# Altium schematic sheet imxbb232.SchDoc: IMXBB
size A3; DocumentNumber: 5; Revision: 2.0; SheetNumber: 5; SheetTotal: 9
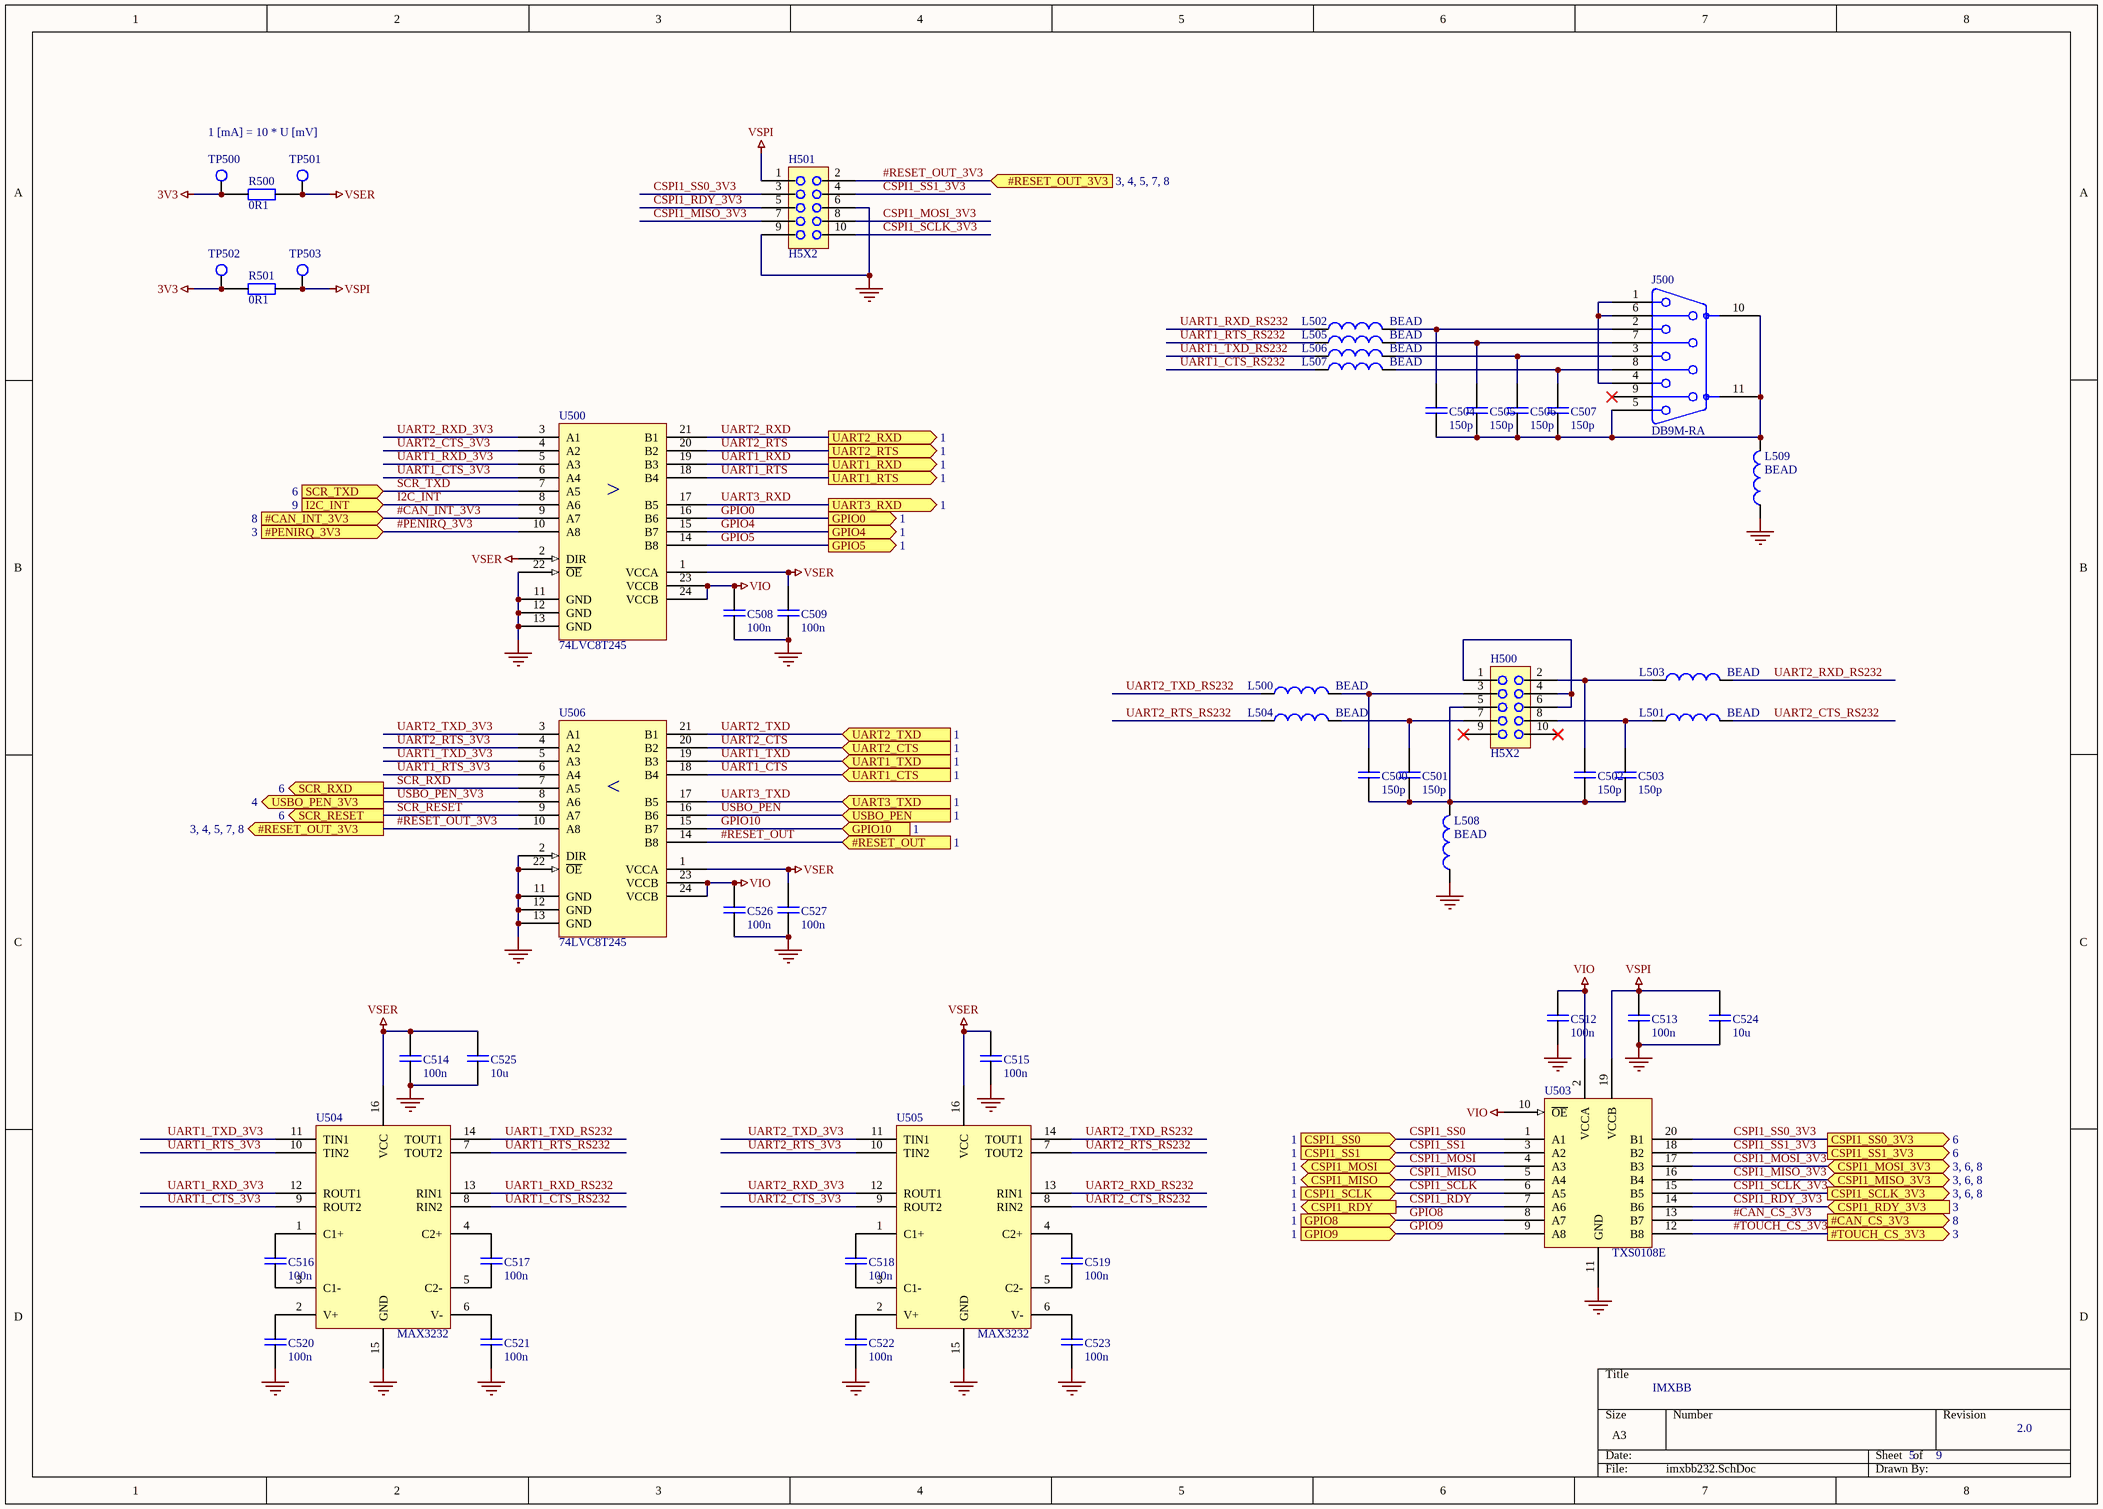
[diagram p0: imxbb232.SchDoc]

## Parts
C500  150p  [0603]
C501  150p  [0603]
C502  150p  [0603]
C503  150p  [0603]
C504  150p  [0603]
C505  150p  [0603]
C506  150p  [0603]
C507  150p  [0603]
C508  100n  [0603]
C509  100n  [0603]
C512  100n  [0603]
C513  100n  [0603]
C514  100n  [0603]
C515  100n  [0603]
C516  100n  [0603]
C517  100n  [0603]
C518  100n  [0603]
C519  100n  [0603]
C520  100n  [0603]
C521  100n  [0603]
C522  100n  [0603]
C523  100n  [0603]
C524  10u  [0805]
C525  10u  [0805]
C526  100n  [0603]
C527  100n  [0603]
H500  H5X2  [H2x5]
H501  H5X2  [H2x5]
J500  DB9M-RA  [DRA9_M_RA]
L500  BEAD  [0603]
L501  BEAD  [0603]
L502  BEAD  [0603]
L503  BEAD  [0603]
L504  BEAD  [0603]
L505  BEAD  [0603]
L506  BEAD  [0603]
L507  BEAD  [0603]
L508  BEAD  [0603]
L509  BEAD  [0603]
R500  0R1  [0603]
R501  0R1  [0603]
TP500  TESTPOINT  [TESTPOINT_2mm]  (value not drawn)
TP501  TESTPOINT  [TESTPOINT_2mm]  (value not drawn)
TP502  TESTPOINT  [TESTPOINT_2mm]  (value not drawn)
TP503  TESTPOINT  [TESTPOINT_2mm]  (value not drawn)
U500  74LVC8T245  [TSSOP24]
U503  TXS0108E  [TSSOP20]
U504  MAX3232  [SOIC16N]
U505  MAX3232  [SOIC16N]
U506  74LVC8T245  [TSSOP24]

## Ports
#CAN_CS_3V3 (out, see 8), #CAN_INT_3V3 (in, see 8), #PENIRQ_3V3 (in, see 3), #RESET_OUT (in, see 1), #RESET_OUT_3V3 (in, see 3, 4, 5, 7, 8), #RESET_OUT_3V3 (out, see 3, 4, 5, 7, 8), #TOUCH_CS_3V3 (out, see 3), CSPI1_MISO (bidir, see 1), CSPI1_MISO_3V3 (bidir, see 3, 6, 8), CSPI1_MOSI (bidir, see 1), CSPI1_MOSI_3V3 (bidir, see 3, 6, 8), CSPI1_RDY (out, see 1), CSPI1_RDY_3V3 (in, see 3), CSPI1_SCLK (in, see 1), CSPI1_SCLK_3V3 (out, see 3, 6, 8), CSPI1_SS0 (in, see 1), CSPI1_SS0_3V3 (out, see 6), CSPI1_SS1 (in, see 1), CSPI1_SS1_3V3 (out, see 6), GPIO0 (out, see 1), GPIO4 (out, see 1), GPIO5 (out, see 1), GPIO8 (in, see 1), GPIO9 (in, see 1), GPIO10 (in, see 1), I2C_INT (in, see 9), SCR_RESET (out, see 6), SCR_RXD (out, see 6), SCR_TXD (in, see 6), UART1_CTS (in, see 1), UART1_RTS (out, see 1), UART1_RXD (out, see 1), UART1_TXD (in, see 1), UART2_CTS (in, see 1), UART2_RTS (out, see 1), UART2_RXD (out, see 1), UART2_TXD (in, see 1), UART3_RXD (out, see 1), UART3_TXD (in, see 1), USBO_PEN (in, see 1), USBO_PEN_3V3 (out, see 4)

## Nets
3V3: R500.1 R501.1 TP500.1 TP502.1
GND: C508.1 C509.1 C512.1 C513.1 C514.1 C515.1 C520.1 C521.1 C522.1 C523.1 C524.1 C525.1 C526.1 C527.1 H501.6 H501.9 L508.1 L509.1 U500.11(GND) U500.12(GND) U500.13(GND) U500.22(~{OE}) U503.11(GND) U504.15(GND) U505.15(GND) U506.2(DIR) U506.11(GND) U506.12(GND) U506.13(GND) U506.22(~{OE})
VIO: C508.2 C512.2 C526.2 U500.23(VCCB) U500.24(VCCB) U503.2(VCCA) U503.10(~{OE}) U506.23(VCCB) U506.24(VCCB)
VSER: C509.2 C514.2 C515.2 C525.2 C527.2 R500.2 TP501.1 U500.1(VCCA) U500.2(DIR) U504.16(VCC) U505.16(VCC) U506.1(VCCA)
VSPI: C513.2 C524.2 H501.1 R501.2 TP503.1 U503.19(VCCB)
#CAN_CS_3V3: U503.13(B7) ; port #CAN_CS_3V3
#CAN_INT_3V3: U500.9(A7) ; port #CAN_INT_3V3
#PENIRQ_3V3: U500.10(A8) ; port #PENIRQ_3V3
#RESET_OUT: U506.14(B8) ; port #RESET_OUT
#RESET_OUT_3V3: H501.2 U506.10(A8) ; port #RESET_OUT_3V3
#TOUCH_CS_3V3: U503.12(B8) ; port #TOUCH_CS_3V3
CSPI1_MISO: U503.5(A4) ; port CSPI1_MISO
CSPI1_MISO_3V3: H501.7 U503.16(B4) ; port CSPI1_MISO_3V3
CSPI1_MOSI: U503.4(A3) ; port CSPI1_MOSI
CSPI1_MOSI_3V3: H501.8 U503.17(B3) ; port CSPI1_MOSI_3V3
CSPI1_RDY: U503.7(A6) ; port CSPI1_RDY
CSPI1_RDY_3V3: H501.5 U503.14(B6) ; port CSPI1_RDY_3V3
CSPI1_SCLK: U503.6(A5) ; port CSPI1_SCLK
CSPI1_SCLK_3V3: H501.10 U503.15(B5) ; port CSPI1_SCLK_3V3
CSPI1_SS0: U503.1(A1) ; port CSPI1_SS0
CSPI1_SS0_3V3: H501.3 U503.20(B1) ; port CSPI1_SS0_3V3
CSPI1_SS1: U503.3(A2) ; port CSPI1_SS1
CSPI1_SS1_3V3: H501.4 U503.18(B2) ; port CSPI1_SS1_3V3
GPIO0: U500.16(B6) ; port GPIO0
GPIO4: U500.15(B7) ; port GPIO4
GPIO5: U500.14(B8) ; port GPIO5
GPIO8: U503.8(A7) ; port GPIO8
GPIO9: U503.9(A8) ; port GPIO9
GPIO10: U506.15(B7) ; port GPIO10
I2C_INT: U500.8(A6) ; port I2C_INT
SCR_RESET: U506.9(A7) ; port SCR_RESET
SCR_RXD: U506.7(A5) ; port SCR_RXD
SCR_TXD: U500.7(A5) ; port SCR_TXD
UART1_CTS: U506.18(B4) ; port UART1_CTS
UART1_CTS_3V3: U500.6(A4) U504.9(ROUT2)
UART1_CTS_RS232: L507.1 U504.8(RIN2)
UART1_RTS: U500.18(B4) ; port UART1_RTS
UART1_RTS_3V3: U504.10(TIN2) U506.6(A4)
UART1_RTS_RS232: L505.1 U504.7(TOUT2)
UART1_RXD: U500.19(B3) ; port UART1_RXD
UART1_RXD_3V3: U500.5(A3) U504.12(ROUT1)
UART1_RXD_RS232: L502.1 U504.13(RIN1)
UART1_TXD: U506.19(B3) ; port UART1_TXD
UART1_TXD_3V3: U504.11(TIN1) U506.5(A3)
UART1_TXD_RS232: L506.1 U504.14(TOUT1)
UART2_CTS: U506.20(B2) ; port UART2_CTS
UART2_CTS_3V3: U500.4(A2) U505.9(ROUT2)
UART2_CTS_RS232: L501.2 U505.8(RIN2)
UART2_RTS: U500.20(B2) ; port UART2_RTS
UART2_RTS_3V3: U505.10(TIN2) U506.4(A2)
UART2_RTS_RS232: L504.1 U505.7(TOUT2)
UART2_RXD: U500.21(B1) ; port UART2_RXD
UART2_RXD_3V3: U500.3(A1) U505.12(ROUT1)
UART2_RXD_RS232: L503.2 U505.13(RIN1)
UART2_TXD: U506.21(B1) ; port UART2_TXD
UART2_TXD_3V3: U505.11(TIN1) U506.3(A1)
UART2_TXD_RS232: L500.1 U505.14(TOUT1)
UART3_RXD: U500.17(B5) ; port UART3_RXD
UART3_TXD: U506.17(B5) ; port UART3_TXD
USBO_PEN: U506.16(B6) ; port USBO_PEN
USBO_PEN_3V3: U506.8(A6) ; port USBO_PEN_3V3
NetC500_1: C500.1 C501.1 C502.1 C503.1 H500.5 L508.2
NetC500_2: C500.2 H500.3 L500.2
NetC501_2: C501.2 H500.7 L504.2
NetC502_2: C502.2 H500.2 L503.1
NetC503_2: C503.2 H500.8 L501.1
NetC504_1: C504.1 C505.1 C506.1 C507.1 J500.5 J500.10(SHIELD) J500.11(SHIELD) L509.2
NetC504_2: C504.2 J500.2 L502.2
NetC505_2: C505.2 J500.7 L505.2
NetC506_2: C506.2 J500.3 L506.2
NetC507_2: C507.2 J500.8 L507.2
NetC516_1: C516.1 U504.3(C1-)
NetC516_2: C516.2 U504.1(C1+)
NetC517_1: C517.1 U504.5(C2-)
NetC517_2: C517.2 U504.4(C2+)
NetC518_1: C518.1 U505.3(C1-)
NetC518_2: C518.2 U505.1(C1+)
NetC519_1: C519.1 U505.5(C2-)
NetC519_2: C519.2 U505.4(C2+)
NetC520_2: C520.2 U504.2(V+)
NetC521_2: C521.2 U504.6(V-)
NetC522_2: C522.2 U505.2(V+)
NetC523_2: C523.2 U505.6(V-)
NetH500_1: H500.1 H500.4 H500.6
NetJ500_1: J500.1 J500.4 J500.6

Not connected (* = marked no-connect by the designer): H500 9* 10*; J500 9(17)*

## Notes on the sheet
- 1 [mA] = 10 * U [mV]
- (near U500) >
- (near U506) <

## Library data of the parts
C500-C509 C512-C527 = C
L500-L509 = FBEAD
R500 R501 = R
TP500-TP503 = TESTPOINT: Testpoint pad; Order number: no component; Component class: TP; Producer: n/a; Assembly type: no component